# Altium schematic sheet sim.SchDoc
size 381 x 241 mm; SheetNumber: 1; SheetTotal: 2
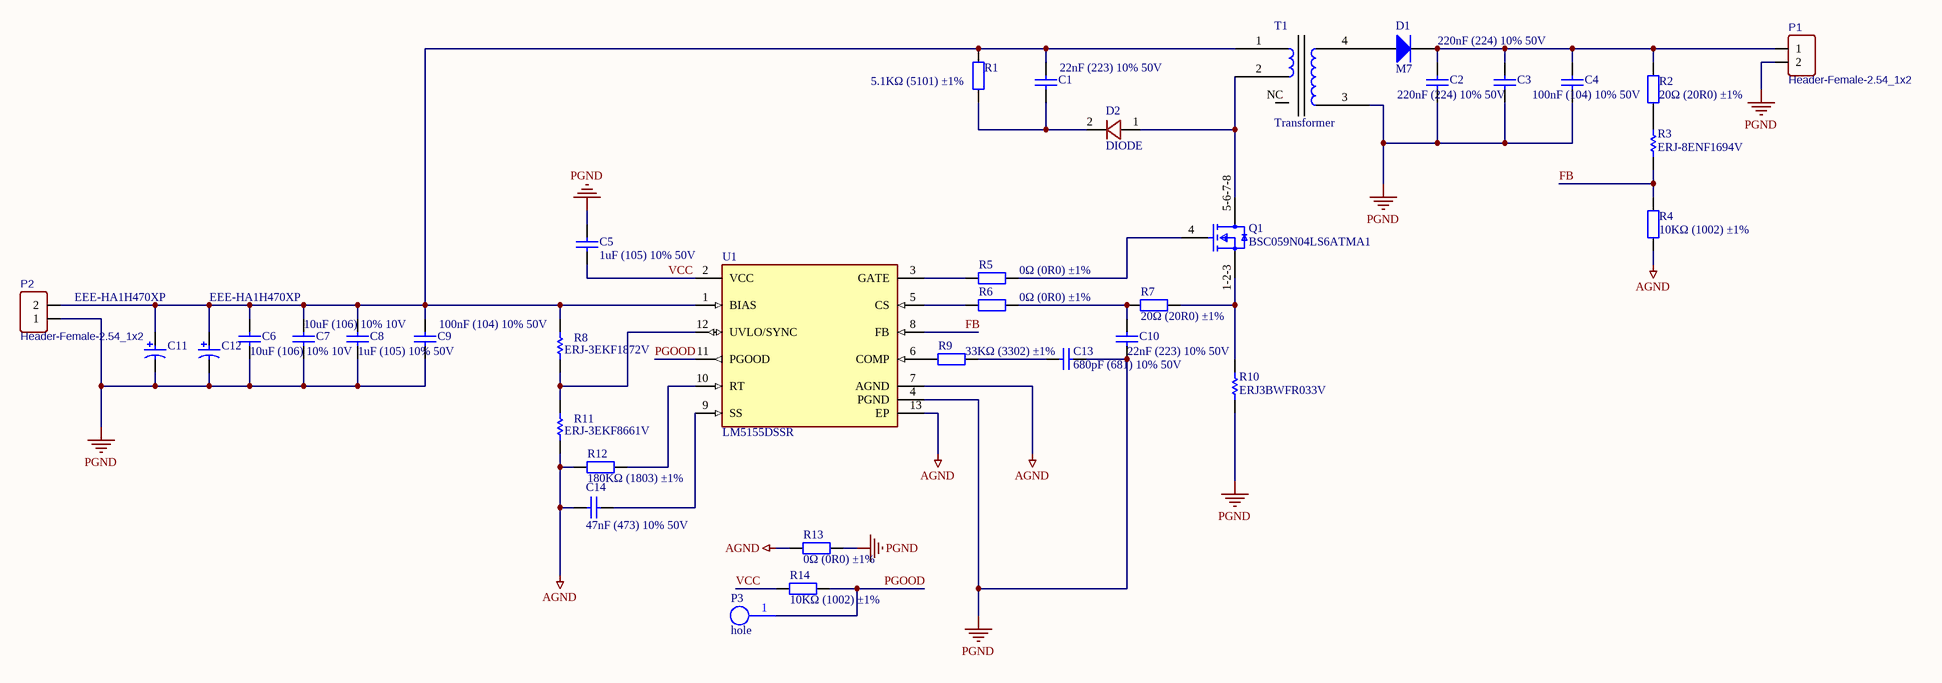
[diagram p0: sim.SchDoc]

## Parts
C1  22nF (223) 10% 50V  [0603_C]
C2  220nF (224) 10% 50V  [1206_C]
C3  220nF (224) 10% 50V  [1206_C]
C4  100nF (104) 10% 50V  [1206_C]
C5  1uF (105) 10% 50V  [0603_C]
C6  10uF (106) 10% 10V  [0603_C]
C7  10uF (106) 10% 10V  [0603_C]
C8  1uF (105) 10% 50V  [0603_C]
C9  100nF (104) 10% 50V  [0603_C]
C10  22nF (223) 10% 50V  [0603_C]
C11  EEE-HA1H470XP  [PNSC-EEE-HA1H470XP-2_V]
C12  EEE-HA1H470XP  [PNSC-EEE-HA1H470XP-2_V]
C13  680pF (681) 10% 50V  [0603_C]
C14  47nF (473) 10% 50V  [0603_C]
D1  M7  [SMA(DO-214AC)_S1]
D2  DIODE  [1N4150]
P1  Header-Female-2.54_1x2  [HDR-TH_2P-P2.54-V-F]
P2  Header-Female-2.54_1x2  [HDR-TH_2P-P2.54-V-F]
P3  hole  [测试点]
Q1  BSC059N04LS6ATMA1  [FP-PG-TDSON-8-MFG]
R1  5.1KΩ (5101) ±1%  [0603_R]
R2  20Ω (20R0) ±1%  [0603_R]
R3  ERJ-8ENF1694V  [RESC3216X70X50LL05T20]
R4  10KΩ (1002) ±1%  [1206_R]
R5  0Ω (0R0) ±1%  [0603_R]
R6  0Ω (0R0) ±1%  [0603_R]
R7  20Ω (20R0) ±1%  [0603_R]
R8  ERJ-3EKF1872V  [RESC1608X55X30LL15T15]
R9  33KΩ (3302) ±1%  [0603_R]
R10  ERJ3BWFR033V  [RESC1608X55X30NL15T15]
R11  ERJ-3EKF8661V  [RESC1608X55X30LL15T15]
R12  180KΩ (1803) ±1%  [0603_R]
R13  0Ω (0R0) ±1%  [0603_R]
R14  10KΩ (1002) ±1%  [0603_R]
T1  Transformer  [TTRN-060S]
U1  LM5155DSSR  [FP-DSS0012B-MFG]

## Nets
AGND: C14.1 R4.1 R11.1 R12.1 R13.1 U1.7(AGND) U1.13(EP)
PGND: C2.1 C3.1 C4.1 C5.2 C6.1 C7.1 C8.1 C9.1 C10.1 C11.2 C12.2 C13.2 P1.2 P2.1 R10.1 R13.2 T1.3 U1.4(PGND)
FB: R3.1 R4.2 U1.8(FB)
PGOOD: P3.1 R14.2 U1.11(PGOOD)
VCC: C5.1 R14.1 U1.2(VCC)
NetC1_1: C1.1 D2.2 R1.1
NetC1_2: C1.2 C6.2 C7.2 C8.2 C9.2 C11.1 C12.1 P2.2 R1.2 R8.2 T1.1 U1.1(BIAS)
NetC2_2: C2.2 C3.2 C4.2 D1.2(K) P1.1 R2.2
NetC10_2: C10.2 R6.2 R7.1
NetC13_1: C13.1 R9.2
NetC14_2: C14.2 U1.9(SS)
NetD1_1: D1.1(A) T1.4
NetD2_1: D2.1 Q1.5-6-7-8(D) T1.2
NetQ1_1-2-3: Q1.1-2-3(S) R7.2 R10.2
NetQ1_4: Q1.4(G) R5.2
NetR2_1: R2.1 R3.2
NetR5_1: R5.1 U1.3(GATE)
NetR6_1: R6.1 U1.5(CS)
NetR8_1: R8.1 R11.2 U1.12(UVLO/SYNC)
NetR9_1: R9.1 U1.6(COMP)
NetR12_2: R12.2 U1.10(RT)

Not connected (* = marked no-connect by the designer): T1 NC(6)

## Library data of the parts
C1 C10 = 0603 22nF (223) 10% 50V: 贴片电容; ComponentLink1Description: 供应商链接; ComponentLink1URL: http://www.szlcsc.com/product/details_21834.html; Package: 0603; Supplier: LC; SuppliersPartNumber: C21122
C2 C3 = 1206 220nF (224) 10% 50V: 贴片电容; ComponentLink1Description: 供应商链接; ComponentLink1URL: http://www.szlcsc.com/product/details_2209.html; Package: 1206; Supplier: LC; SuppliersPartNumber: C1857
C4 = 1206 100nF (104) 10% 50V: 贴片电容; ComponentLink1Description: 供应商链接; ComponentLink1URL: http://www.szlcsc.com/product/details_25237.html; Package: 1206; Supplier: LC; SuppliersPartNumber: C24497
C5 C8 = 0603 1uF (105) 10% 50V: 贴片电容; ComponentLink1Description: 供应商链接; ComponentLink1URL: http://www.szlcsc.com/product/details_16531.html; Package: 0603; Supplier: LC; SuppliersPartNumber: C15849
C6 C7 = 0603 10uF (106) 10% 10V: 贴片电容; ComponentLink1Description: 供应商链接; ComponentLink1URL: http://www.szlcsc.com/product/details_20411.html; Package: 0603; Supplier: LC; SuppliersPartNumber: C19702
C9 = 0603 100nF (104) 10% 50V: 贴片电容; ComponentLink1Description: 供应商链接; ComponentLink1URL: http://www.szlcsc.com/product/details_15331.html; Package: 0603; Supplier: LC; SuppliersPartNumber: C14663
C11 C12 = CMP-0736-00001-1: Aluminum Electrolytic Capacitor, 47 uF +/- 20%, 50 V, -40 to 105 degC, 2-Pin 6.6 x 6.6 x 8 mm SMD, RoHS, Tape and Reel, Tape and Reel; Manufacturer: Panasonic; Capacitance Tolerance: +/- 20%; Cap.: 47 uF; Ripple Current: 63 mA; Rated Voltage: 50 V; PackageReference: EEE-HA1H470XP-2; ComponentLink3Description: Package Specification; ComponentLink3URL: http://industrial.panasonic.com/www-data/pdf/ABA0000/ABA0000PE248.pdf; ComponentLink2Description: Datasheet; Mounting Technology: Surface Mount; DatasheetVersion: Sep-13; ComponentLink1URL: http://industrial.panasonic.com/; Temp. Range: -40 to 105 degC; PackageVersion: Sep-13; PartNumber: EEE-HA1H470XP; ComponentLink1Description: Manufacturer URL; Packing: Tape and Reel; ComponentLink2URL: http://industrial.panasonic.com/www-data/pdf/ABA0000/ABA0000CE3.pdf; PackageDescription: 2-Pin SMD, Body 6.6 x 6.6 mm, Height 8 mm; RoHS: TRUE
C13 = 0603 680pF (681) 10% 50V: 贴片电容; ComponentLink1Description: 供应商链接; ComponentLink1URL: http://www.szlcsc.com/product/details_1982.html; Package: 0603; Supplier: LC; SuppliersPartNumber: C1630
C14 = 0603 47nF (473) 10% 50V: 贴片电容; ComponentLink1Description: 供应商链接; ComponentLink1URL: http://www.szlcsc.com/product/details_1974.html; Package: 0603; Supplier: LC; SuppliersPartNumber: C1622
D1 = SMA(DO-214AC) M7: 二极管; Notepad: 1N4007 4007 编号C2464 已经停售, 使用新物料编号C95872; ComponentLink1Description: 供应商链接; ComponentLink1URL: http://www.szlcsc.com/product/details_2841.html; Package: SMA(DO-214AC); Supplier: LC; SuppliersPartNumber: C95872
D2 = 1N4150
P1 P2 = Header-Female-2.54_1x2: BOM_Manufacturer: BOOMELE; BOM_Manufacturer Part: 2.54-1*2PFemale; BOM_Supplier: LCSC; BOM_Supplier Part: C49661; BOM_JLCPCB Part Class: Extended Part; spicePre: P; spiceSymbolName: Header-Female-2.54_1x2
P3 = 测试点
Q1 = CMP-32901-000139-1: TRENCH <= 40V; Manufacturer: Infineon; Transconductance: 100S; Turn On Delay Time: 3ns; Number Of Channels: 1; Gate Charge At Vgs: 9.4nC @ 10V; Continuous Drain Current: 17A; Max Junction Temp: +175°C; Reverse Recovery Charge: 22nC; Turn Off Delay Time: 8ns; Input Capacitace At Vds: 640pF @ 20V; Typ Forward Diode Voltage: 0.92V; Threshold Vgs Max: 2.3V; Max Forward Diode Voltage: 1V; Power Dissipation: 3W; Depletion Mode: False; Threshold Vgs Min: 1.3V; Gate To Source Voltage: 20V; Pulse Drain Current: 236A; Reverse Recovery Time: 13ns; Rthja Max: 50°C/W; Drain To Source Resistance: 4.7mΩ; Temperature Range High: +175°C; Package: PG-TDSON-8; Digikey Description: TRENCH <= 40V; Temperature Range Low: -55°C; Footprint Url: https://www.infineon.com/cms/en/product/packages/PG-TDSON/PG-TDSON-8-17/; Number Of N Channels: 1; Drain To Source Voltage: 40V; RoHS: TRUE; Temperature: -55°C to +175°C; Category: Trans; ComponentLink2URL: https://www.infineon.com/dgdl/Infineon-BSC059N04LS6-DS-v02_00-EN.pdf?fileId=5546d462689a790c0168bd22cfc6481f; Drain To Source Breakdown Voltage: 40V; Device Class L2: Transistors; Manufacturer Part Number: BSC059N04LS6ATMA1; ComponentLink2Description: Datasheet; Device Class L3: MOSFETs; Height: 1.1mm; Automotive: No; Octopart: https://octopart.com/bsc059n04ls6atma1-infineon-98039929; Lead Free: Yes; Device Class L1: Discrete Semiconductors
R1 = 0603 5.1KΩ (5101) 1%: 贴片电阻; ComponentLink1Description: 供应商链接; ComponentLink1URL: http://www.szlcsc.com/product/details_23913.html; Package: 0603; Supplier: LC; SuppliersPartNumber: C23186
R2 R7 = 0603 20Ω (20R0) 1%: 贴片电阻; ComponentLink1Description: 供应商链接; ComponentLink1URL: http://www.szlcsc.com/product/details_23677.html; Package: 0603; Supplier: LC; SuppliersPartNumber: C22950
R3 = CMP-2003-00151-1: Manufacturer: Panasonic; Part Number: ERJ-8ENF1694V
R4 = 1206 10KΩ (1002) 1%: 贴片电阻; ComponentLink1Description: 供应商链接; ComponentLink1URL: http://www.szlcsc.com/product/details_18590.html; Package: 1206; Supplier: LC; SuppliersPartNumber: C17902
R5 R6 R13 = 0603 0Ω (0R0) 1%: 贴片电阻; ComponentLink1Description: 供应商链接; ComponentLink1URL: http://www.szlcsc.com/product/details_21903.html; Package: 0603; Supplier: LC; SuppliersPartNumber: C21189
R8 = CMP-2000-00304-1: Manufacturer: Panasonic; Part Number: ERJ-3EKF1872V
R9 = 0603 33KΩ (3302) 1%: 贴片电阻; ComponentLink1Description: 供应商链接; ComponentLink1URL: http://www.szlcsc.com/product/details_4623.html; Package: 0603; Supplier: LC; SuppliersPartNumber: C4216
R10 = CMP-2000-00175-1: Manufacturer: Panasonic; Part Number: ERJ3BWFR033V
R11 = CMP-2000-00670-1: Manufacturer: Panasonic; Part Number: ERJ-3EKF8661V
R12 = 0603 180KΩ (1803) 1%: 贴片电阻; ComponentLink1Description: 供应商链接; ComponentLink1URL: http://www.szlcsc.com/product/details_23554.html; Package: 0603; Supplier: LC; SuppliersPartNumber: C22827
R14 = 0603 10KΩ (1002) 1%: 贴片电阻; ComponentLink1Description: 供应商链接; ComponentLink1URL: http://www.szlcsc.com/product/details_26547.html; Package: 0603; Supplier: LC; SuppliersPartNumber: C25804
T1 = TTRN-060S
U1 = CMP-04918-000431-1: POWER MANAGEMENT